# Altium schematic sheet GTM_FreePinsHeaders.SchDoc
size A4
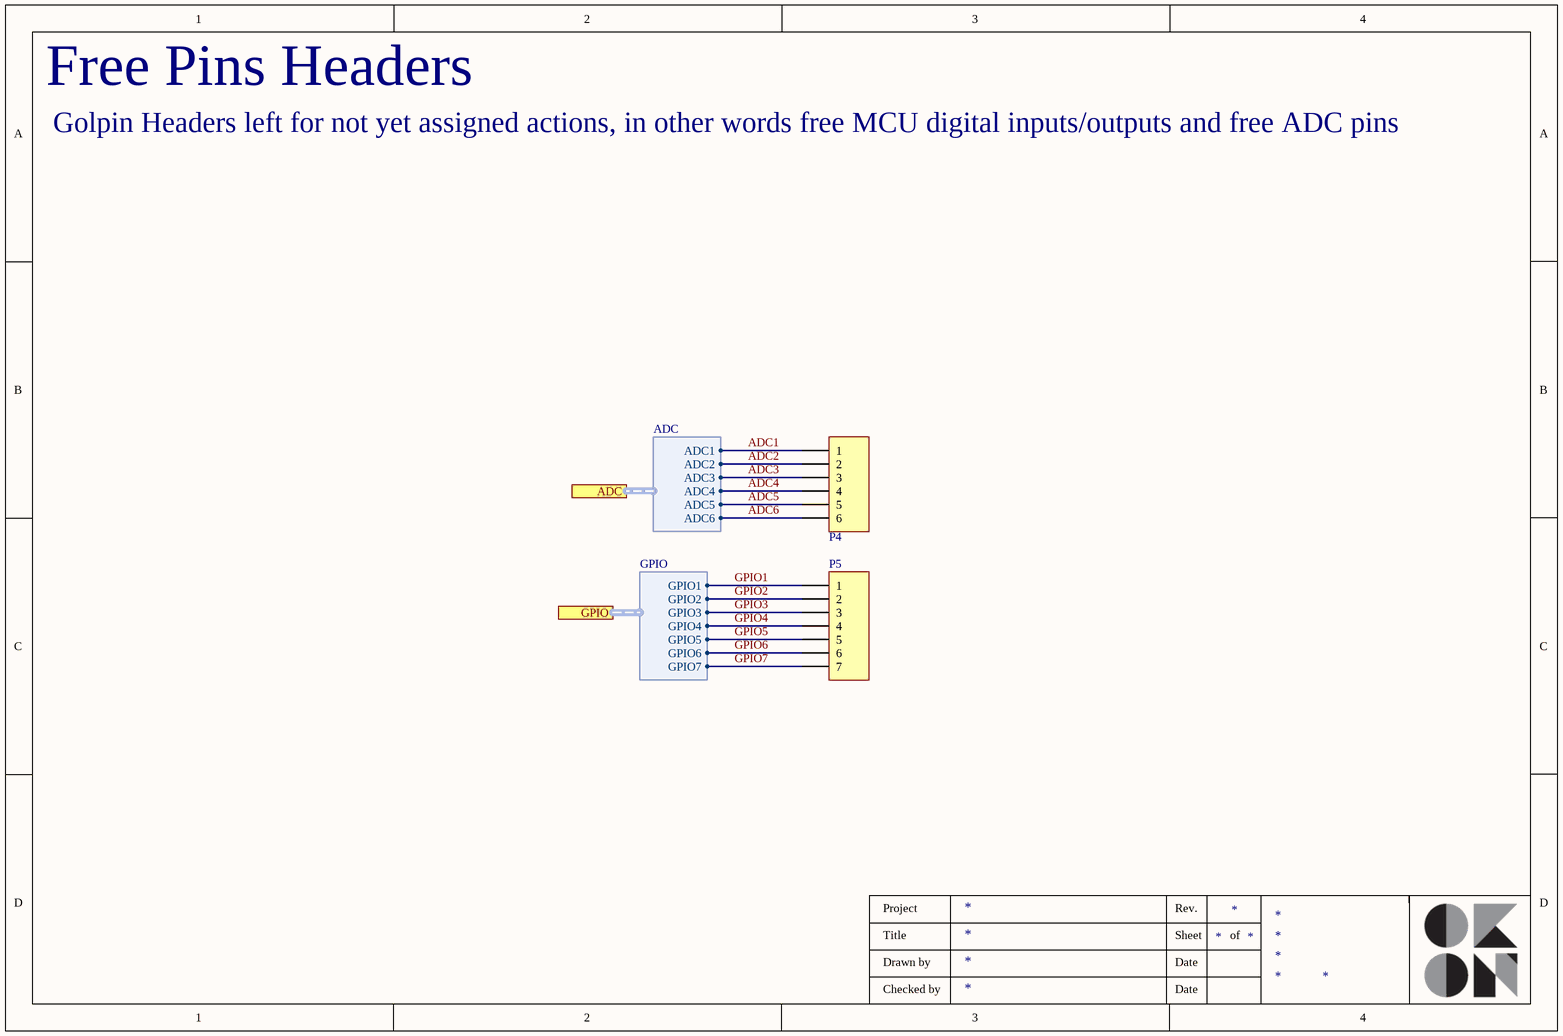
[diagram p0: GTM_FreePinsHeaders.SchDoc]

## Parts
P4  HDR1X6  [HDR1X6]  (value not drawn)
P5  HDR1X7  [HDR1X7]  (value not drawn)

## Ports
ADC (harness ADC), GPIO (harness GPIO)

## Harnesses
ADC: ADC1, ADC2, ADC3, ADC4, ADC5, ADC6
GPIO: GPIO1, GPIO2, GPIO3, GPIO4, GPIO5, GPIO6, GPIO7

## Nets
ADC1: P4.1 ; port ADC.ADC1
ADC2: P4.2 ; port ADC.ADC2
ADC3: P4.3 ; port ADC.ADC3
ADC4: P4.4 ; port ADC.ADC4
ADC5: P4.5 ; port ADC.ADC5
ADC6: P4.6 ; port ADC.ADC6
GPIO1: P5.1 ; port GPIO.GPIO1
GPIO2: P5.2 ; port GPIO.GPIO2
GPIO3: P5.3 ; port GPIO.GPIO3
GPIO4: P5.4 ; port GPIO.GPIO4
GPIO5: P5.5 ; port GPIO.GPIO5
GPIO6: P5.6 ; port GPIO.GPIO6
GPIO7: P5.7 ; port GPIO.GPIO7

## Notes on the sheet
- Free Pins Headers
- Golpin Headers left for not yet assigned actions, in other words free MCU digital inputs/outputs and free ADC pins
- Project
- Rev.
- Title
- Drawn by
- Date
- Sheet
- of
- Checked by

## Library data of the parts
P4 = HDR1X6: Header, 6-Pin; LatestRevisionDate: 17-Jul-2002; LatestRevisionNote: Re-released for DXP Platform.; Publisher: Altium Limited
P5 = HDR1X7: Header, 7-Pin; LatestRevisionDate: 17-Jul-2002; LatestRevisionNote: Re-released for DXP Platform.; Publisher: Altium Limited